# Altium project Soldering Station.PrjPcb
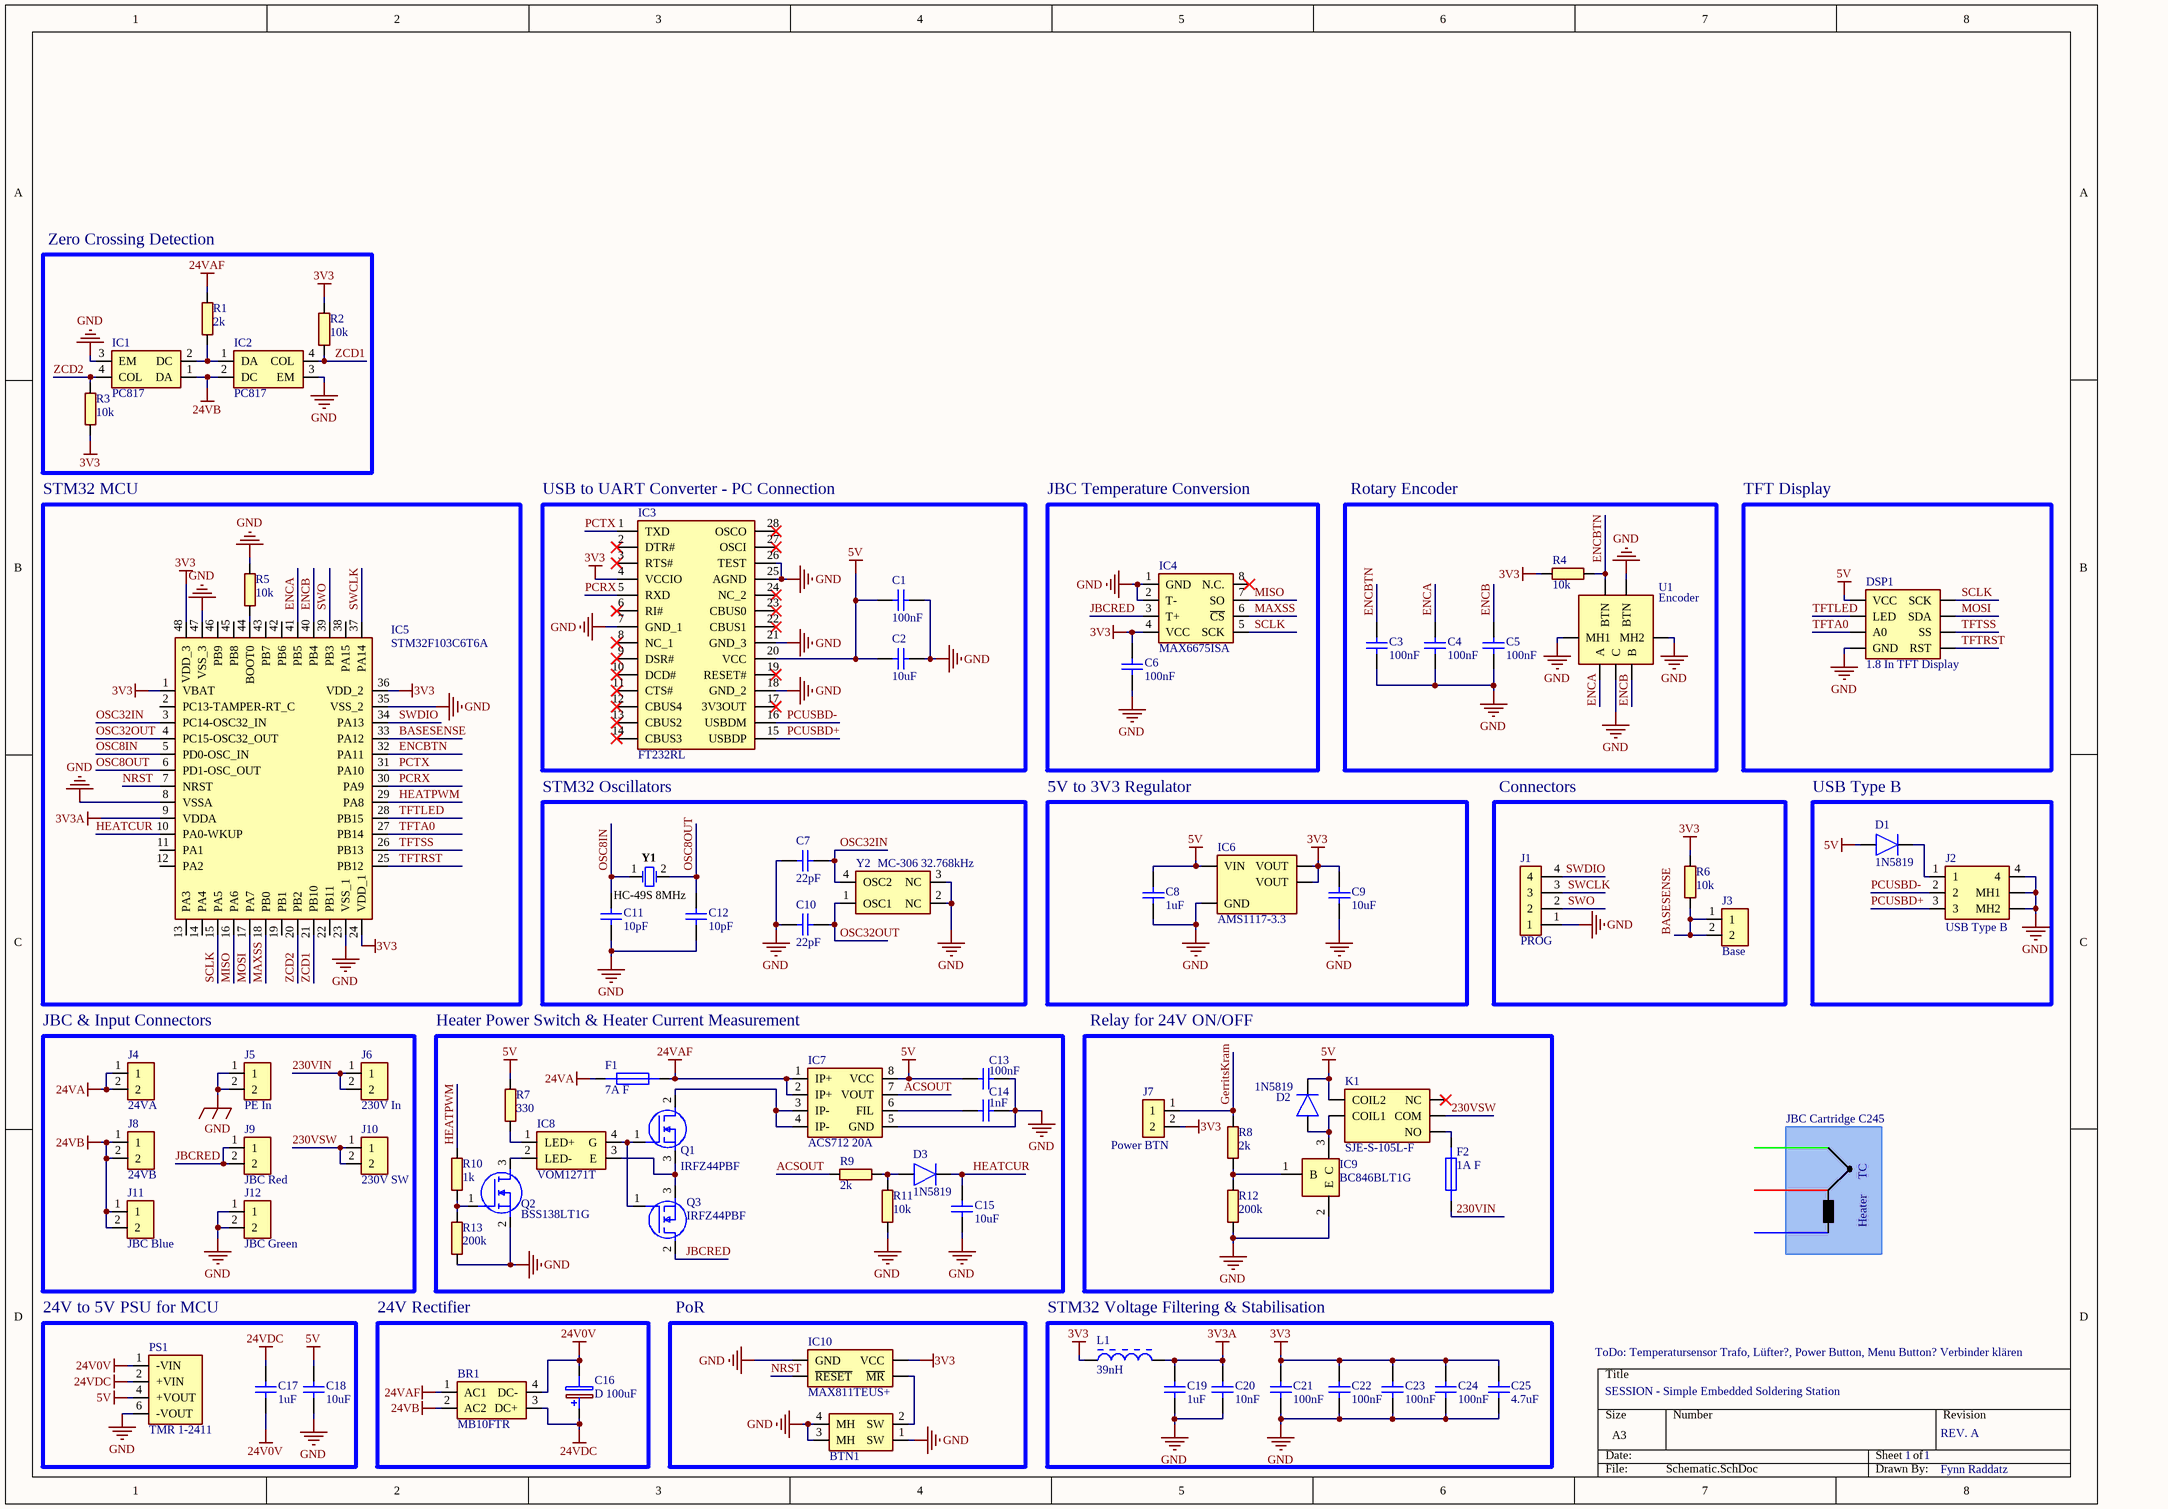
[diagram p0: Schematic.SchDoc]
1 sheet, 77 parts. Net scope: global (net labels, ports and power ports of the same name join across sheets).
Board file: PCB1.PcbDoc

## Sheet Schematic.SchDoc
size A3; SheetNumber: 1; SheetTotal: 1

### Parts
BR1  MB10FTR  [SOP250P670X160-4N]
BTN1  SMD Button 6x6mm Angled  [SMD Button 6x6 Angled]  (value not drawn)
C1  100nF  [CAPC2012 METRIC]
C2  10uF  [CAPC2012 METRIC]
C3  100nF  [CAPC2012 METRIC]
C4  100nF  [CAPC2012 METRIC]
C5  100nF  [CAPC2012 METRIC]
C6  100nF  [CAPC2012 METRIC]
C7  22pF  [CAPC2012 METRIC]
C8  1uF  [CAPC2012 METRIC]
C9  10uF  [CAPC2012 METRIC]
C10  22pF  [CAPC2012 METRIC]
C11  10pF  [CAPC2012 METRIC]
C12  10pF  [CAPC2012 METRIC]
C13  100nF  [CAPC2012 METRIC]
C14  1nF  [CAPC2012 METRIC]
C15  10uF  [CAPC2012 METRIC]
C16  D 100uF  [TANTAL-D]
C17  1uF  [CAPC2012 METRIC]
C18  10uF  [CAPC2012 METRIC]
C19  1uF  [CAPC2012 METRIC]
C20  10nF  [CAPC2012 METRIC]
C21  100nF  [CAPC2012 METRIC]
C22  100nF  [CAPC2012 METRIC]
C23  100nF  [CAPC2012 METRIC]
C24  100nF  [CAPC2012 METRIC]
C25  4.7uF  [CAPC2012 METRIC]
D1  1N5819  [SOD3716X145N]
D2  1N5819  [SOD3716X145N]
D3  1N5819  [SOD3716X145N]
DSP1  1.8 In TFT Display  [1.8 Inch TFT Display]
F1  7A F  [Fuse Holder 5x20mm]
F2  1A F  [Fuse Holder 5x20mm]
IC1  PC817  [SOP254P975X460-4N]
IC2  PC817  [SOP254P975X460-4N]
IC3  FT232RL  [SOP65P778X200-28N]
IC4  MAX6675ISA  [SOIC127P600X175-8N]
IC5  STM32F103C6T6A  [QFP50P900X900X160-48N]
IC6  AMS1117-3.3  [SOT229P700X180-4N]
IC7  ACS712 20A  [SOIC127P600X175-8N]
IC8  VOM1271T  [SOP254P675X240-4N]
IC9  BC846BLT1G  [SOT96P237X111-3N]
IC10  MAX811TEUS+  [MAX811REUST]
J1  PROG  [HDRV4W95P0X254_1X4_1016X254X854P]
J2  USB Type B  [SS52300001]
J3  Base  [2 Pin Header BIG PADS]
J4  24VA  [2 Pin Header BIG PADS]
J5  PE In  [2 Pin Header BIG PADS]
J6  230V In  [2 Pin Header BIG PADS]
J7  Power BTN  [HDRV2W110P0X254_1X2_508X254X854P]
J8  24VB  [2 Pin Header BIG PADS]
J9  JBC Red  [2 Pin Header BIG PADS]
J10  230V SW  [2 Pin Header BIG PADS]
J11  JBC Blue  [2 Pin Header BIG PADS]
J12  JBC Green  [2 Pin Header BIG PADS]
K1  SJE-S-105L-F  [SJES105LF]
L1  39nH  [LIRD-LI0805H151R-10-2_V]
PS1  TMR 1-2411  [TMR10511]
Q1  IRFZ44PBF  [TO254P465X1024X2050-3P]
Q2  BSS138LT1G  [SOT96P237X111-3N]
Q3  IRFZ44PBF  [TO254P465X1024X2050-3P]
R1  2k  [RESC2012X65N]
R2  10k  [RESC2012X65N]
R3  10k  [RESC2012X65N]
R4  10k  [RESC2012X65N]
R5  10k  [RESC2012X65N]
R6  10k  [RESC2012X65N]
R7  330  [RESC2012X65N]
R8  2k  [RESC2012X65N]
R9  2k  [RESC2012X65N]
R10  1k  [RESC2012X65N]
R11  10k  [RESC2012X65N]
R12  200k  [RESC2012X65N]
R13  200k  [RESC2012X65N]
U1  Encoder  [EC11B152442D]
Y1  HC-49S 8MHz  [FOX-HC49SDLF_V]
Y2  MC-306 32.768kHz  [MC306327680KA3ROHS]

### Blocks framed on the sheet
Zero Crossing Detection: IC1 IC2 R1-R3
STM32 MCU: IC5 R5
USB to UART Converter - PC Connection: C1 C2 IC3
JBC Temperature Conversion: C6 IC4
Rotary Encoder: C3-C5 R4 U1
TFT Display: DSP1
STM32 Oscillators: C7 C10-C12 Y1 Y2
5V to 3V3 Regulator: C8 C9 IC6
Connectors: J1 J3 R6
USB Type B: D1 J2
JBC & Input Connectors: J4-J6 J8-J12
Heater Power Switch & Heater Current Measurement: C13-C15 D3 F1 IC7 IC8 Q1-Q3 R7 R9-R11 R13
Relay for 24V ON/OFF: D2 F2 IC9 J7 K1 R8 R12
24V to 5V PSU for MCU: C17 C18 PS1
24V Rectifier: BR1 C16
PoR: BTN1 IC10
STM32 Voltage Filtering & Stabilisation: C19-C25 L1

### Nets
3V3: C6.2 C9.1 C21.2 C22.2 C23.2 C24.2 C25.2 IC3.4(VCCIO) IC4.4(VCC) IC5.1(VBAT) IC5.24(VDD_1) IC5.36(VDD_2) IC5.48(VDD_3) IC6.2(VOUT) IC6.4(VOUT) IC10.4(VCC) J7.2 L1.1 R2.1 R3.1 R4.2 R6.1
3V3A: C19.2 C20.2 IC5.9(VDDA) L1.2
5V: C1.1 C2.1 C8.1 C13.2 C18.2 D1.2(A) D2.1(K) DSP1.8(VCC) IC3.20(VCC) IC6.3(VIN) IC7.8(VCC) K1.2(COIL2) PS1.4(+VOUT) R7.2
24V0V: BR1.4(DC-) C16.2(-) C17.1 PS1.1(-VIN)
24VA: F1.1(F1) J4.1 J4.2
24VAF: BR1.1(AC1) F1.2(F2) IC7.1(IP+) IC7.2(IP+) R1.2
24VB: BR1.2(AC2) IC1.1(DA) IC2.2(DC) J8.1 J8.2 J11.1 J11.2
24VDC: BR1.3(DC+) C16.1(+) C17.2 PS1.2(+VIN)
GND: BTN1.1(SW) BTN1.3(MH) BTN1.4(MH) C1.2 C2.2 C3.1 C4.1 C5.1 C6.1 C7.2 C8.2 C9.2 C10.2 C11.1 C12.1 C13.1 C14.1 C15.2 C18.1 C19.1 C20.1 C21.1 C22.1 C23.1 C24.1 C25.1 DSP1.7(GND) IC1.3(EM) IC2.3(EM) IC3.7(GND_1) IC3.18(GND_2) IC3.21(GND_3) IC3.25(AGND) IC3.26(TEST) IC4.1(GND) IC4.2(T-) IC5.8(VSSA) IC5.23(VSS_1) IC5.35(VSS_2) IC5.47(VSS_3) IC6.1(GND) IC7.5(GND) IC9.2(E) IC10.1(GND) J1.1 J2.4 J2.MH1 J2.MH2 J5.1 J5.2 J12.1 J12.2 PS1.6(-VOUT) Q2.2(S) R5.2 R11.2 R12.1 R13.1 U1.C U1.MH1 U1.MH2 U1.MH4(BTN) Y2.2(NC) Y2.3(NC)
230VIN: F2.1(F1) J6.1 J6.2
230VSW: J10.1 J10.2 K1.3(COM)
ACSOUT: IC7.7(VOUT) R9.2
BASESENSE: IC5.33(PA12) J3.1 J3.2 R6.2
ENCA: C4.2 IC5.41(PB5) U1.A
ENCB: C5.2 IC5.40(PB4) U1.B
ENCBTN: C3.2 IC5.32(PA11) R4.1 U1.MH3(BTN)
GerritsKram: J7.1 R8.2
HEATCUR: C15.1 D3.1(K) IC5.10(PA0-WKUP)
HEATPWM: IC5.29(PA8) R10.2
JBCRED: IC4.3(T+) J9.1 J9.2 Q3.2(D)
MAXSS: IC4.6(~{CS}) IC5.18(PB0)
MISO: IC4.7(SO) IC5.16(PA6)
MOSI: DSP1.3(SDA) IC5.17(PA7)
NRST: IC5.7(NRST) IC10.2(~{RESET})
OSC8IN: C11.2 IC5.5(PD0-OSC_IN) Y1.1
OSC8OUT: C12.2 IC5.6(PD1-OSC_OUT) Y1.2
OSC32IN: C7.1 IC5.3(PC14-OSC32_IN) Y2.4(OSC2)
OSC32OUT: C10.1 IC5.4(PC15-OSC32_OUT) Y2.1(OSC1)
PCRX: IC3.5(RXD) IC5.30(PA9)
PCTX: IC3.1(TXD) IC5.31(PA10)
PCUSBD+: IC3.15(USBDP) J2.3
PCUSBD-: IC3.16(USBDM) J2.2
SCLK: DSP1.2(SCK) IC4.5(SCK) IC5.15(PA5)
SWCLK: IC5.37(PA14) J1.3
SWDIO: IC5.34(PA13) J1.4
SWO: IC5.39(PB3) J1.2
TFTA0: DSP1.4(A0) IC5.27(PB14)
TFTLED: DSP1.1(LED) IC5.28(PB15)
TFTRST: DSP1.5(RST) IC5.25(PB12)
TFTSS: DSP1.6(SS) IC5.26(PB13)
ZCD1: IC2.4(COL) IC5.21(PB10) R2.2
ZCD2: IC1.4(COL) IC5.20(PB2) R3.2
NetBTN1_2: BTN1.2(SW) IC10.3(~{MR})
NetC14_2: C14.2 IC7.6(FIL)
NetD1_1: D1.1(K) J2.1
NetD2_2: D2.2(A) IC9.3(C) K1.1(COIL1)
NetD3_2: D3.2(A) R9.1 R11.1
NetF2_2: F2.2(F2) K1.4(NO)
NetIC1_2: IC1.2(DC) IC2.1(DA) R1.1
NetIC5_44: IC5.44(BOOT0) R5.1
NetIC7_3: IC7.3(IP-) IC7.4(IP-) Q1.2(D)
NetIC8_1: IC8.1(LED+) R7.1
NetIC8_2: IC8.2(LED-) Q2.3(D)
NetIC8_3: IC8.3(E) Q1.3(S) Q3.3(S)
NetIC8_4: IC8.4(G) Q1.1(G) Q3.1(G)
NetIC9_1: IC9.1(B) R8.1 R12.2
NetQ2_1: Q2.1(G) R10.1 R13.2

Not connected (* = marked no-connect by the designer): IC3 2(DTR#)* 3(RTS#)* 6(RI#)* 8(NC_1)* 9(DSR#)* 10(DCD#)* 11(CTS#)* 12(CBUS4)* 13(CBUS2)* 14(CBUS3)* 17(3V3OUT)* 19(RESET#)* 22(CBUS1)* 23(CBUS0)* 24(NC_2)* 27(OSCI)* 28(OSCO)*; IC4 8(N.C.)*; IC5 2(PC13-TAMPER-RT_C) 11(PA1) 12(PA2) 13(PA3) 14(PA4) 19(PB1) 22(PB11) 38(PA15) 42(PB6) 43(PB7) 45(PB8) 46(PB9); K1 5(NC)*

### Notes on the sheet
- JBC Cartridge C245
- TC
- Heater
- ToDo: Temperatursensor Trafo, Lüfter?, Power Button, Menu Button? Verbinder klären
- SESSION - Simple Embedded Soldering Station
- 1
- REV. A
- Fynn Raddatz

### Library data of the parts
BR1 = MB10FTR: Bridge Rectifier; Manufacturer_Name: SMC Diode Solutions; Datasheet Link: http://www.smc-diodes.com/propdf/MB05F-MB10F%20N1456%20REV.A.pdf; Height: 1.6mm; Manufacturer_Part_Number: MB10FTR
C1-C15 C17-C25 = CL21B104KACNNNC: Capacitor; Manufacturer_Name: Samsung Electro-Mechanics; Datasheet Link: http://www.samsungsem.com/kr/support/product-search/mlcc/__icsFiles/afieldfile/2016/08/18/S_CL21B104KACNNNC.pdf; Height: 0.95mm; Manufacturer_Part_Number: CL21B104KACNNNC; Mouser Part Number: N/A; Mouser Price/Stock: https://www.mouser.co.uk/ProductDetail/Samsung-Electro-Mechanics/CL21B104KACNNNC?qs=yOVawPpwOwnhB47kNbieFw%3D%3D; Arrow Part Number: CL21B104KACNNNC; Arrow Price/Stock: https://www.arrow.com/en/products/cl21b104kacnnnc/samsung-electro-mechanics
C16 = TANTAL-D: Capacitor Tantalum
D1-D3 = 1N5819HW-7-F: Diode; Manufacturer_Name: Diodes Inc.; Datasheet Link: http://www.diodes.com/_files/datasheets/ds30217.pdf; Height: 1.45mm; Manufacturer_Part_Number: 1N5819HW-7-F; Mouser Part Number: 621-1N5819HW-F; Mouser Price/Stock: https://www.mouser.co.uk/ProductDetail/Diodes-Incorporated/1N5819HW-7-F/?qs=NQ47qNm99eDyWTEd07miYA%3D%3D; Arrow Part Number: 1N5819HW-7-F; Arrow Price/Stock: https://www.arrow.com/en/products/1n5819hw-7-f/diodes-incorporated
DSP1 = TFT Display 1.8In SPI: Display
F1 F2 = Fuse Holder 5x20mm
IC1 IC2 = PC817X2NIP0F: Integrated Circuit; Manufacturer_Name: Sharp Microelectronics; Datasheet Link: https://ew.componentsearchengine.com/Datasheets/2/PC817X2NIP0F.pdf; Height: 4.6mm; Manufacturer_Part_Number: PC817X2NIP0F; Mouser Part Number: N/A; Mouser Price/Stock: https://www.mouser.co.uk/ProductDetail/Sharp-Microelectronics/PC817X2NIP0F?qs=je7EQiYm86lhc4x%252BMeaZDQ%3D%3D
IC3 = FT232RL: Integrated Circuit; Manufacturer_Name: FTDI Chip; Datasheet Link: http://www.ftdichip.com/Support/Documents/DataSheets/ICs/DS_FT232R.pdf; Height: 2mm; Manufacturer_Part_Number: FT232RL; Arrow Part Number: FT232RL; Arrow Price/Stock: https://www.arrow.com/en/products/ft232rl/ftdi-chip
IC4 = MAX6675ISA: Integrated Circuit; Manufacturer_Name: Maxim Integrated; Datasheet Link: http://datasheets.maximintegrated.com/en/ds/MAX6675.pdf; Height: 1.75mm; Manufacturer_Part_Number: MAX6675ISA; Mouser Part Number: N/A; Mouser Price/Stock: https://www.mouser.com/Search/Refine.aspx?Keyword=N%2FA
IC5 = STM32F103C6T6A: Integrated Circuit; Manufacturer_Name: STMicroelectronics; Datasheet Link: http://www.st.com/st-web-ui/static/active/en/resource/technical/document/datasheet/CD00210843.pdf; Height: 1.6mm; Manufacturer_Part_Number: STM32F103C6T6A; Mouser Part Number: 511-STM32F103C6T6A; Mouser Price/Stock: https://www.mouser.co.uk/ProductDetail/STMicroelectronics/STM32F103C6T6A?qs=%252BB84zevwoRBiGXbwVLvaMw%3D%3D; Arrow Part Number: STM32F103C6T6A; Arrow Price/Stock: https://www.arrow.com/en/products/stm32f103c6t6a/stmicroelectronics
IC6 = AMS1117-3.3: Integrated Circuit; Manufacturer_Name: Advanced Monolithic Systems; Datasheet Link: http://www.advanced-monolithic.com/pdf/ds1117.pdf; Height: 1.8mm; Manufacturer_Part_Number: AMS1117-3.3
IC7 = ACS712ELCTR-05B-T: Integrated Circuit; Manufacturer_Name: Sharp Microelectronics; Datasheet Link: https://www.allegromicro.com/~/media/Files/Datasheets/ACS712-Datasheet.ashx; Height: 1.75mm; Manufacturer_Part_Number: ACS712ELCTR-05B-T
IC8 = VOM1271T: Integrated Circuit; Manufacturer_Name: Vishay; Datasheet Link: http://www.mouser.com/ds/2/427/vom1271t-244790.pdf; Height: 2.4mm; Manufacturer_Part_Number: VOM1271T; Mouser Part Number: 78-VOM1271T; Mouser Price/Stock: https://www.mouser.co.uk/ProductDetail/Vishay-Semiconductors/VOM1271T?qs=9vrc9xEJKyxSd3E39M%252BFqQ%3D%3D; Arrow Part Number: VOM1271T; Arrow Price/Stock: https://www.arrow.com/en/products/vom1271t/vishay?region=nac
IC9 = BC846BLT1G: Integrated Circuit; Manufacturer_Name: ON Semiconductor; Datasheet Link: http://www.onsemi.com/pub/Collateral/BC846ALT1-D.PDF; Height: 1.11mm; Manufacturer_Part_Number: BC846BLT1G; Mouser Part Number: 863-BC846BLT1G; Mouser Price/Stock: https://www.mouser.co.uk/ProductDetail/onsemi/BC846BLT1G?qs=vNc2DXHODiJuwwGLruzsRg%3D%3D; Arrow Part Number: BC846BLT1G; Arrow Price/Stock: https://www.arrow.com/en/products/bc846blt1g/on-semiconductor
IC10 = MAX811TEUS+: Integrated Circuit; Manufacturer_Name: Maxim Integrated; Datasheet Link: https://pdfserv.maximintegrated.com/en/ds/MAX811-MAX812.pdf; Manufacturer_Part_Number: MAX811TEUS+
J1 = 61300411121: Connector; Manufacturer_Name: Wurth Elektronik; Datasheet Link: http://katalog.we-online.de/em/datasheet/6130xx11121.pdf; Height: 8.54mm; Manufacturer_Part_Number: 61300411121; Mouser Part Number: 710-61300411121; Mouser Price/Stock: https://www.mouser.co.uk/ProductDetail/Wurth-Elektronik/61300411121?qs=PhR8RmCirEYQcLLqXD8rAA%3D%3D
J2 = USB Type B Connector: Connector; Manufacturer_Name: Bel; Manufacturer_Part_Number: SS-52300-001; Datasheet Link: https://belfuse.com/resources/datasheets/stewartconnector/ds-stw-usb-2.0-type-b-connectors.pdf; Height: 10.82mm; Mouser Part Number: 530-SS-52300-001
J3-J6 J8-J12 = 2 Pin Header Big Pad: Connector; Manufacturer_Name: Wurth Elektronik; Manufacturer_Part_Number: 61300211121; Datasheet Link: https://componentsearchengine.com/Datasheets/2/61300211121.pdf; Height: 8.54mm; Mouser Part Number: 710-61300211121; Mouser Price/Stock: https://www.mouser.co.uk/ProductDetail/Wurth-Elektronik/61300211121/?qs=t4813l51qx%252B1A5GYDQxPlw%3D%3D
J7 = 61300211121: Connector; Manufacturer_Name: Wurth Elektronik; Datasheet Link: https://componentsearchengine.com/Datasheets/2/61300211121.pdf; Height: 8.54mm; Manufacturer_Part_Number: 61300211121; Mouser Part Number: 710-61300211121; Mouser Price/Stock: https://www.mouser.co.uk/ProductDetail/Wurth-Elektronik/61300211121/?qs=t4813l51qx%252B1A5GYDQxPlw%3D%3D
K1 = SJE-S-105L-F: Relay or Contactor; Manufacturer_Name: Sanyou Relays; Datasheet Link: https://4donline.ihs.com/images/VipMasterIC/IC/SAEA/SAEAS00006/SAEAS00006-1.pdf?hkey=EF798316E3902B6ED9A73243A3159BB0; Height: 16.1mm; Manufacturer_Part_Number: SJE-S-105L-F
L1 = CMP-2000-06404-1: Chip Bead, 100 MHz, 5 A, -40 to 125 degC, 2-Pin SMD (0805), RoHS, Tape and Reel; Manufacturer: Laird; DC Resistance (DCR) (Max): 10mOhm; Current Rating (Max): 5A; Kits: 240-2227-ND-KITEMIFERRITEBEADCHIPSMD; Filter Type: Power,SignalLine; Impedance @ Frequency: 80Ohm@100MHz; Online Catalog: HISeries; Other Names: 240-2395-1; Catalog Drawings: (HI,HZ,LI,MI)0805Series_1.10mmMax.Height; Package Version: Rev. D, 08/2013; Number of Lines: 1; Package / Case: 0805(2012Metric); Package URL: http://cdn.lairdtech.com/home/brandworld/files/LI0805H151R-10.pdf; Standard Package: 1; Manufacturer URL: https://www.lairdtech.com/; Ratings: -; Height (Max): 0.043"(1.10mm); Package Description: 2-Pin Surface Mount Device, Body 2 x 1.25 mm; Category: Filters; Series: HI; Packaging: CutTape(CT); Package Reference: LI0805H15R-10-2; Operating Temperature: -40°C~125°C; Datasheet URL: http://cdn.lairdtech.com/home/brandworld/files/HI0805R800R-10.pdf; Size / Dimension: 0.079"Lx0.049"W(2.00mmx1.25mm); Datasheet Version: Rev. E, 08/2013; Mounting Type: SurfaceMount; Family: FerriteBeadsandChips; Mounting Technology: SurfaceMount
PS1 = TMR_1-2411: Power Supply; Manufacturer_Name: Traco Power; Datasheet Link: https://tracopower.com/tmr1-datasheet/; Height: 11.5mm; Manufacturer_Part_Number: TMR 1-2411; Mouser Part Number: 495-TMR-1-2411; Mouser Price/Stock: https://www.mouser.co.uk/ProductDetail/TRACO-Power/TMR-1-2411?qs=ckJk83FOD0UjkjrMKL4VtA%3D%3D
Q1 Q3 = IRFZ44PBF: MOSFET (N-Channel); Manufacturer_Name: Vishay; Datasheet Link: https://www.vishay.com/docs/91291/91291.pdf; Height: 4.65mm; Manufacturer_Part_Number: IRFZ44PBF; Mouser Part Number: 844-IRFZ44PBF; Mouser Price/Stock: https://www.mouser.co.uk/ProductDetail/Vishay-Semiconductors/IRFZ44PBF?qs=%2FRKvNCQzLu0R%252BpFoqVUQ5w%3D%3D; Arrow Part Number: IRFZ44PBF; Arrow Price/Stock: https://www.arrow.com/en/products/irfz44pbf/vishay?region=europe
Q2 = BSS138LT1G: MOSFET (N-Channel); Manufacturer_Name: ON Semiconductor; Datasheet Link: http://www.onsemi.com/pub/Collateral/BSS138LT1-D.PDF; Height: 1.11mm; Manufacturer_Part_Number: BSS138LT1G; Mouser Part Number: 863-BSS138LT1G; Mouser Price/Stock: https://www.mouser.co.uk/ProductDetail/onsemi/BSS138LT1G?qs=vNc2DXHODiKPZ2y3rQhTYQ%3D%3D; Arrow Part Number: BSS138LT1G; Arrow Price/Stock: https://www.arrow.com/en/products/bss138lt1g/on-semiconductor?region=nac
R1-R13 = Res 0805: Resistor; Manufacturer_Name: Stackpole Electronics Inc.; Manufacturer_Part_Number: RMCF0805ZT0R00; Datasheet Link: https://www.seielect.com/Catalog/SEI-RMCF_RMCP.pdf; Height: 0.65mm; Arrow Part Number: RMCF0805ZT0R00; Arrow Price/Stock: https://www.arrow.com/en/products/rmcf0805zt0r00/stackpole-electronics
U1 = EC11B152442D: Manufacturer_Name: ALPS; Height: 31mm; Manufacturer_Part_Number: EC11B152442D; Mouser Part Number: N/A; Mouser Price/Stock: https://www.mouser.com/Search/Refine.aspx?Keyword=N%2FA
Y1 = CMP-2100-03639-1: Resistance Weld Crystal, 8 MHz, +/- 30 ppm, -20 to 70 degC, 2-Pin SMD, RoHS, Tape and Reel; Manufacturer: FOX Electronics; Series Resistance: 80Ohm; Load Capacitance: 20pF; Tolerance: 50ppm; Frequency Tolerance: 30ppm; Datasheet URL: http://www.foxonline.com/pdfs/hc49sdlf.pdf; Package Reference: HC49SDLF; Height: 4.5mm; Mount: SurfaceMount; Packaging: TapeandReel; Length: 11.7mm; Termination: SMD/SMT; Number of Pins: 2; Depth: 5mm; Frequency: 8MHz; Min Operating Temperature: -20degC; Package Quantity: 1000; RoHSCompliant: True; Lead Free: LeadFree; Width: 5mm; Case/Package: SMD/SMT; Manufacturer URL: http://www.foxonline.com/; Max Operating Temperature: 70degC; REACH SVHC: NoSVHC; Datasheet Version: 42064.0; Package Description: 2-Pin Surface Mount Device, Body 5 x 11.7 mm; Frequency Stability: 50ppm; ESR (Equivalent Series Resistance): 80Ohm; Radiation Hardening: No
Y2 = MC-306_32.7680K-A3_ROHS: Crystal or Oscillator; Manufacturer_Name: Epson Timing; Manufacturer_Part_Number: MC-306 32.7680K-A3:ROHS; Datasheet Link: https://componentsearchengine.com/Datasheets/1/MC-306 32.7680K-A3_ROHS.pdf; Height: 2.54mm; Mouser Part Number: 732-MC306-32.7KA3R; Mouser Price/Stock: https://www.mouser.co.uk/ProductDetail/Epson-Timing/MC-306-327680K-A3ROHS/?qs=CU9taR8hkvbxBMNmXnQ1pw%3D%3D